# Altium schematic sheet SDMMC.SchDoc
size A; SheetNumber: 7; SheetTotal: 15
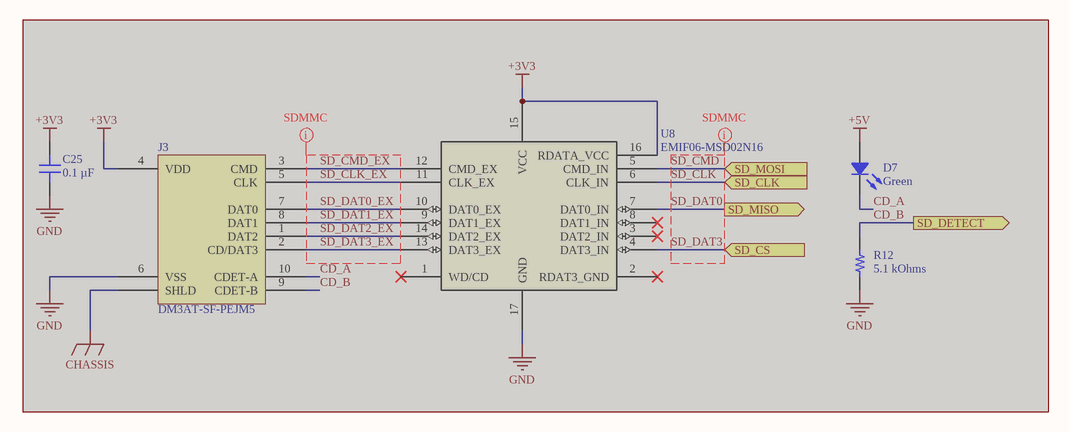
[diagram p0: SDMMC.SchDoc]

## Parts
C25  0.1 µF  [CAP 0402_1005]  (masked out: inside a compile mask, not in the netlist)
D7  Green  [LED 0603_1608 GREEN]  (masked out: inside a compile mask, not in the netlist)
J3  DM3AT-SF-PEJM5  [HIROSE DM3AT-SF-PEJM5]  (masked out: inside a compile mask, not in the netlist)
R12  5.1 kOhms  [RES 0603_1608]  (masked out: inside a compile mask, not in the netlist)
U8  EMIF06-MSD02N16  [EMIF06MSD02N16]  (masked out: inside a compile mask, not in the netlist)

## Ports
SD_CLK (in), SD_CS (in), SD_DETECT (out), SD_MISO (out), SD_MOSI (in)

## Layout directives
net class SDMMC: SD_CLK, SD_CLK_EX, SD_CMD, SD_CMD_EX, SD_DAT0, SD_DAT0_EX, SD_DAT1_EX, SD_DAT2_EX, SD_DAT3, SD_DAT3_EX

## Library data of the parts
C25 = C0402C104K4RECAUTO: CAP CER 0402 0.1UF 16V X7R 10%; manufacturer: KEMET; Part Number: C0402C104K4RECAUTO; Capacitance: 0.1 µF; Applications: Automotive, ESD Protection; componentlink1description: Datasheet; componentlink1url: https://api.kemet.com/component-edge/download/datasheet/C0402C104K4RECAUTO.pdf; componentlink2description: DigiKey Link; componentlink2url: https://www.digikey.com/en/products/detail/kemet/C0402C104K4RECAUTO/8563695; Device Package: 0402 (1005 Metric); lastupdated: 2/9/2024 8:04:38 PM; Lifecycle Status: Active; Minimum Order: 1; Mounting Type: Surface Mount, MLCC; Operating Temperature: -55°C ~ 125°C; Package / Case: 0402 (1005 Metric); packaging: TapeAndReel; partid: 1731; Part Status: Active; price: 0.01; Ratings: AEC-Q200; series: ESD SMD Auto X7R; Size / Dimension: 0.039" L x 0.020" W (1.00mm x 0.50mm); Supplier 1: DigiKey; Supplier Part Number 1: 399-17167-1-ND; Temperature Coefficient: X7R; Thickness (Max): 0.022" (0.55mm); Tolerance: ±10%; value: 0.1 µF; Voltage - Rated: 16V
D7 = SECU1413C-TG20: GREEN, D=564NM, IV=75MCD; Manufacturer: Sanken; Current - Test: 20mA; Lens Size: 0.92mm Dia; Lens Style: Round with Domed Top; Millicandela Rating: 75mcd; Viewing Angle: 60°; Voltage - Forward (Vf) (Typ): 2.1V; Wavelength - Dominant: 564nm; Part Number: SECU1413C-TG20; Color: Green; ComponentLink1Description: Datasheet; ComponentLink1URL: https://www.semicon.sanken-ele.co.jp/sk_content/secu1413c-tg20_ds_en.pdf; ComponentLink2Description: DigiKey Link; ComponentLink2URL: https://www.digikey.com/en/products/detail/sanken/SECU1413C-TG20/16639358; Device Package: 0603 (1608 Metric); Height (Max): 1.48mm; LastUpdated: 6/3/2024 7:58:48 PM; Lifecycle Status: Active; Minimum Order: 1; Mounting Type: Surface Mount; Package / Case: 0603 (1608 Metric); Packaging: CutTape; PartId: 1166; Part Status: Active; Price: 0.28; Series: -; Size / Dimension: 1.60mm L x 0.80mm W; Supplier 1: DigiKey; Supplier Part Number 1: 1261-SECU1413C-TG20TR-ND; Supplier Device Package: 0603; Value: Green
J3 = DM3AT-SF-PEJM5: CONN MICRO SD CARD PUSH-PUSH R/A; Manufacturer: Hirose Electric Co Ltd; Card Type: Secure Digital - microSD™; Connector Type: Connector and Ejector; Insertion, Removal Method: Push In, Push Out; Number of Positions: 10 (8 + 2); Part Number: DM3AT-SF-PEJM5; ComponentLink1Description: Datasheet; ComponentLink1URL: https://www.hirose.com/product/document?clcode=CL0609-0033-6-00&productname=DM3AT-SF-PEJ2M5&series=DM3&documenttype=Catalog&lang=en&documentid=D49662_en; ComponentLink2Description: DigiKey Link; ComponentLink2URL: //digikey.com/product-detail/en/hirose-electric-co-ltd/DM3AT-SF-PEJM5/HR1964TR-ND/2533565; Contact Finish: Gold; Features: Switch; Height Above Board: 0.066" (1.68mm); LastUpdated: 12/16/2019 8:34:40 PM; Lifecycle Status: 0; Minimum Order: 1; Mounting Feature: Normal, Standard - Top; Mounting Type: Surface Mount, Right Angle; Packaging: TapeAndReel; Part Status: Active; Price: 1.41; Series: DM3; Supplier 1: DigiKey; Supplier Part Number 1: HR1964TR-ND
R12 = RMCF0603JG5K10: RES 5.1K OHM 5% 1/10W 0603; Manufacturer: Stackpole Electronics Inc; Power (Watts): 0.1W, 1/10W; Temperature Coefficient: ±200ppm/°C; Part Number: RMCF0603JG5K10; Value: 5.1 kOhms; ComponentLink1Description: Datasheet; ComponentLink1URL: https://www.seielect.com/catalog/sei-packaging.pdf; ComponentLink2Description: DigiKey Link; ComponentLink2URL: https://www.digikey.com/en/products/detail/stackpole-electronics-inc/RMCF0603JG5K10/1712287; Composition: Thick Film; Device Package: 0603 (1608 Metric); Features: Automotive AEC-Q200; Height - Seated (Max): 0.022" (0.55mm); LastUpdated: 2/9/2024 8:43:35 PM; Lifecycle Status: Active; Minimum Order: 1; Number of Terminations: 2; Operating Temperature: -55°C ~ 155°C; Package / Case: 0603 (1608 Metric); Packaging: CutTape; PartId: 5180; Part Status: Active; Price: 0.01; Ratings: AEC-Q200; Resistance: 5.1 kOhms; Series: RMCF; Size / Dimension: 0.061" L x 0.031" W (1.55mm x 0.80mm); Supplier 1: DigiKey; Supplier Part Number 1: 738-RMCF0603JG5K10CT-ND; Supplier Device Package: 0603; Tolerance: ±5%
U8 = EMIF06-MSD02N16: No Description Available; Mfr_Name: STMicroelectronics; RefDes: RefDes; Type: Type